# EAGLE schematic core (EAGLE 6.2)
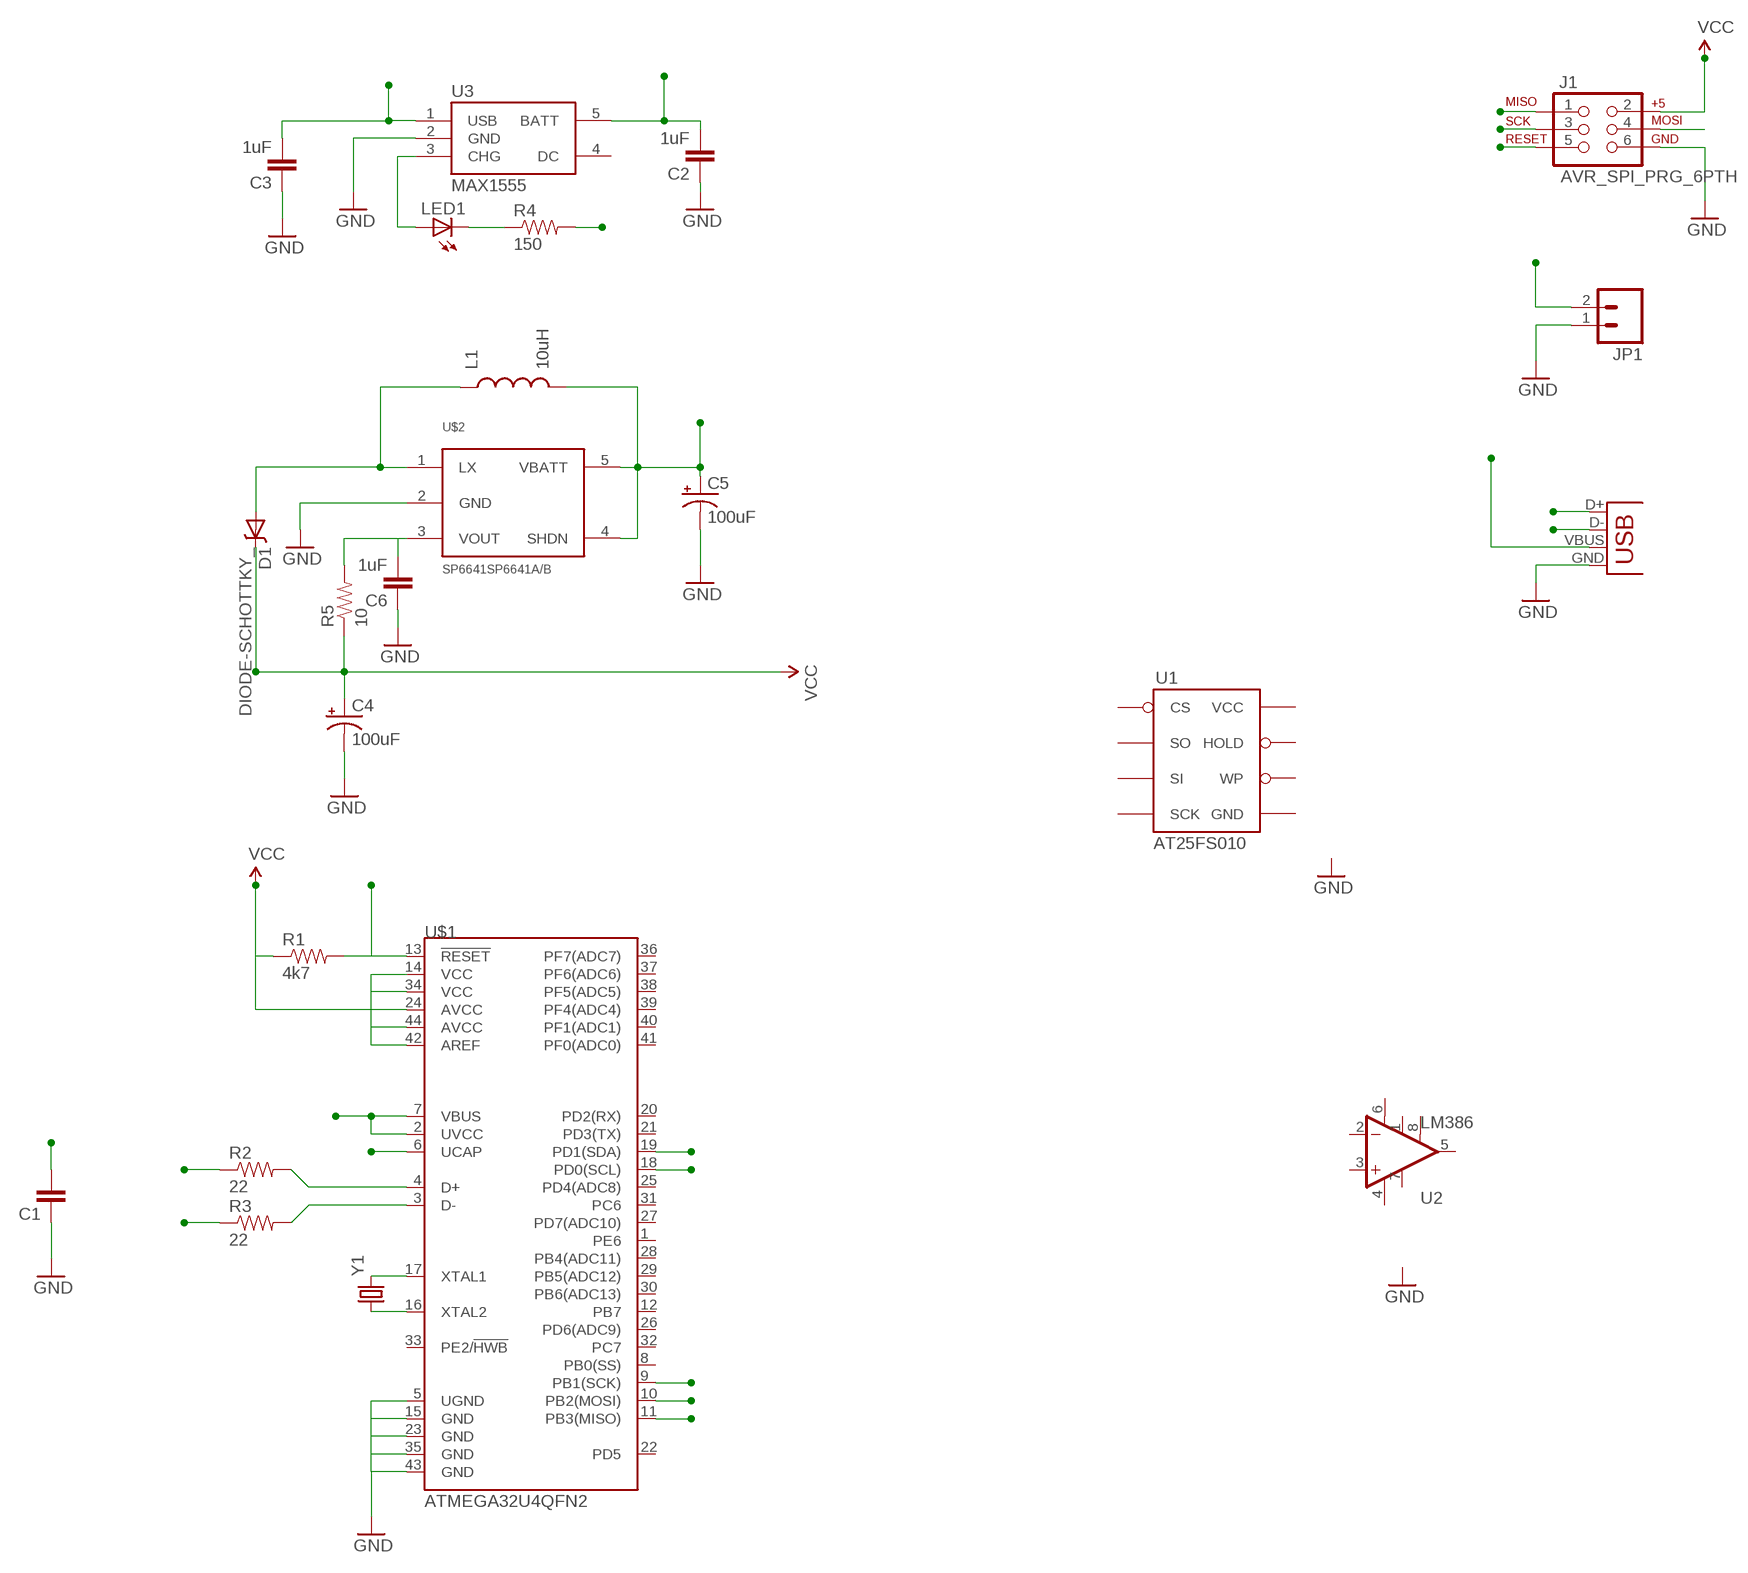
[diagram p0: schematic, sheet 1]

## Parts
C1  CAP1206  [1206]
C2  1uF  CAP1206  [1206]
C3  1uF  CAP1206  [1206]
C4  100uF  CAP_POLE  [PANASONIC_E]
C5  100uF  CAP_POLE  [PANASONIC_E]
C6  1uF  CAP0603-CAP  [0603-CAP]
D1  DIODE-SCHOTTKY_  [SMA-DIODE]
J1  AVR_SPI_PRG_6PTH  [2X3]
JP1  M02-JST-2MM-SMT  [JST-2-SMD]
L1  10uH  INDUCTORCR75  [CR75]
LED1  LED0603  [LED-0603]
R1  4k7  220-5%  [0603-RES]
R2  22  220-5%  [0603-RES]
R3  22  220-5%  [0603-RES]
R4  150  220-5%  [0603-RES]
R5  10  220-5%  [0603-RES]
U1  AT25FS010  [SO08WIDE]
U2  LM386  [DIP08]
U3  MAX1555  [SOT23-5]
U$1  ATMEGA32U4QFN2  [QFN-44-NOPAD]
U$2  SP6641SP6641A/B  [SOT23-5]
X1  USBSMD  [USB-MINIB]
Y1  CRYSTAL5X3  [CRYSTAL-SMD-5X3]

## Nets
/RESET: J1.5 R1.2 U$1.13(!RESET)
GND: C1.1 C2.1 C3.1 C4.- C5.- C6.1 J1.6 JP1.1 U3.2(GND) U$1.5(UGND) U$1.15(GND) U$1.23(GND) U$1.35(GND) U$1.43(GND) U$2.2(GND) X1.GND
MISO: J1.1 U$1.11(PB3(MISO))
MOSI: J1.4 U$1.10(PB2(MOSI))
N$1: R3.2 U$1.3(D-)
N$2: R2.2 U$1.4(D+)
N$5: LED1.A U3.3(CHG)
N$6: LED1.C R4.1
N$7: D1.A L1.P$1 U$2.1(LX)
N$9: U$1.17(XTAL1) Y1.3
N$10: U$1.16(XTAL2) Y1.1
N$11: C6.2 R5.2 U$2.3(VOUT)
SCK: J1.3 U$1.9(PB1(SCK))
SCL: U$1.18(PD0(SCL))
SDA: U$1.19(PD1(SDA))
UCAP: C1.2 U$1.6(UCAP)
USB_D+: R2.1 X1.D+
USB_D-: R3.1 X1.D-
VBATT: C2.2 C5.+ JP1.2 L1.P$2 U3.5(BATT) U$2.4(SHDN) U$2.5(VBATT)
VBUS: C3.2 R4.2 U3.1(USB) U$1.2(UVCC) U$1.7(VBUS) X1.VBUS
VCC: C4.+ D1.C J1.2 R1.1 R5.1 U$1.14(VCC) U$1.24(AVCC) U$1.34(VCC) U$1.42(AREF) U$1.44(AVCC)
Unconnected: U1.1(CS) U1.2(SO) U1.3(WP) U1.4(GND) U1.5(SI) U1.6(SCK) U1.7(HOLD) U1.8(VCC) U2.1(GAIN) U2.2(-IN) U2.3(+IN) U2.5(OUT) U2.7(BP) U2.8(GAIN) U3.4(DC) U$1.1(PE6) U$1.8(PB0(SS)) U$1.12(PB7) U$1.20(PD2(RX)) U$1.21(PD3(TX)) U$1.22(PD5) U$1.25(PD4(ADC8)) U$1.26(PD6(ADC9)) U$1.27(PD7(ADC10)) U$1.28(PB4(ADC11)) U$1.29(PB5(ADC12)) U$1.30(PB6(ADC13)) U$1.31(PC6) U$1.32(PC7) U$1.33(PE2/!HWB) U$1.36(PF7(ADC7)) U$1.37(PF6(ADC6)) U$1.38(PF5(ADC5)) U$1.39(PF4(ADC4)) U$1.40(PF1(ADC1)) U$1.41(PF0(ADC0))

## Power pins joined to a net without a drawn wire
V+: U2.6(V+)
V-: U2.4(V-)

## Library data of the parts
C1-C3 C6 = SparkFun-Capacitors:CAP: Capacitor Standard 0603 ceramic capacitor, and 0.1" leaded capacitor.
C4 C5 = SparkFun-Capacitors:CAP_POL: Capacitor Polarized These are standard SMD and PTH capacitors. Normally 10uF, 47uF, and 100uF in electrolytic and tantalum varieties. Always verify the external diameter of the through hole cap, it varies with capacity, voltage, and manufacturer. The EIA devices should be standard.
D1 = SparkFun-DiscreteSemi:DIODE-SCHOTTKY: Commonly MBRA140.
J1 = SparkFun-Connectors:AVR_SPI_PRG_6: AVR ISP 6 Pin This is the reduced ISP connector for AVR programming. Common on Arduino. This footprint will take up less PCB space and can be used with a 10-pin to 6-pin adapter such as SKU: BOB-08508
JP1 = SparkFun-Connectors:M02: Header 2 Standard 2-pin 0.1" header. Use with straight break away headers (SKU : PRT-00116), right angle break away headers (PRT-00553), swiss pins (PRT-00743), machine pins (PRT-00117), and female headers (PRT-00115). Molex polarized connector foot print use with SKU : PRT-08233 with associated crimp pins and housings.
L1 = SparkFun-Passives:INDUCTOR: Inductors Basic Inductor/Choke - 0603 and 1206. Footprints are not proven and vary greatly between part numbers.
LED1 = SparkFun-LED:LED: LEDs Standard schematic elements and footprints for 5mm, 3mm, 1206, and 0603 sized LEDs. 5mm - Spark Fun Electronics SKU : COM-00529 (and others)
R1-R5 = SparkFun-Resistors:220-5%: 220-ohm SMT 1/8W - 5% (0805) RES-07866; PROD_ID: RES-07866; VALUE: 220
U1 = SparkFun-DigitalIC:AT25FS010: 1-Mbit SPI flash memory
U2 = SparkFun-AnalogIC:LM386: low voltage audio power amplifier
U3 = SparkFun-PowerIC:MAX1555: MAX1555 Lithium Charger IC SOT-23 Lithium Polymer charging IC. Schematic element and footprint proven. Spark Fun Electronics SKU : COM-00674
U$1 = SparkFun-DigitalIC:ATMEGA32U4: Atmel 44-pin 8-bit Microcontroller with 32KBytes of ISP Flash and USB Controller
U$2 = Sipex Custom:SP6641
X1 = SparkFun-Connectors:USB: USB Connectors USB-B-PTH is fully proven SKU : PRT-00139 USB-miniB is fully proven SKU : PRT-00587 USB-A-PCB is untested. USB-A-H is throughly reviewed, but untested. Spark Fun Electronics SKU : PRT-00437 USB-B-SMT is throughly reviewed, but untested. Needs silkscreen touching up. USB-A-S has not been used/tested USB-MB-H has not been used/tested
Y1 = SparkFun-FreqCtrl:CRYSTAL: Various standard crystals. Proven footprints. Spark Fun Electronics SKU : COM-00534